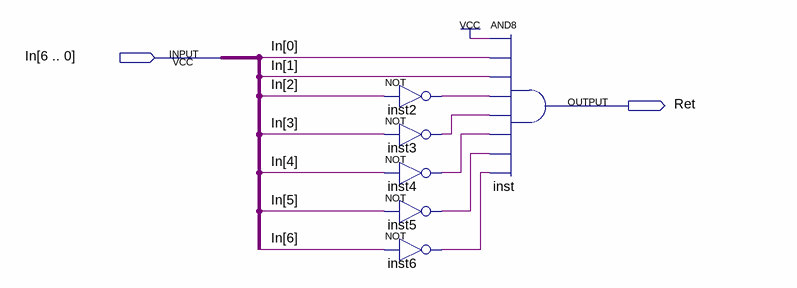
[diagram p0: schematic sheet]
// Quartus schematic On_4_Ret.bdf as structural Verilog: 6 symbols, 2 pins
module On_4_Ret (
  input  [6:0] In,
  output Ret
);

  wire inst2_out, inst3_out, inst4_out, inst5_out, inst6_out;

  not inst2 (inst2_out, In[2]);
  not inst3 (inst3_out, In[3]);
  not inst4 (inst4_out, In[4]);
  not inst5 (inst5_out, In[5]);
  not inst6 (inst6_out, In[6]);
  and inst (Ret, 1'b1, In[0], In[1], inst2_out, inst3_out, inst4_out, inst5_out, inst6_out);
endmodule
